# Altium schematic sheet Power.SchDoc
size A4; SheetNumber: 2; SheetTotal: 4
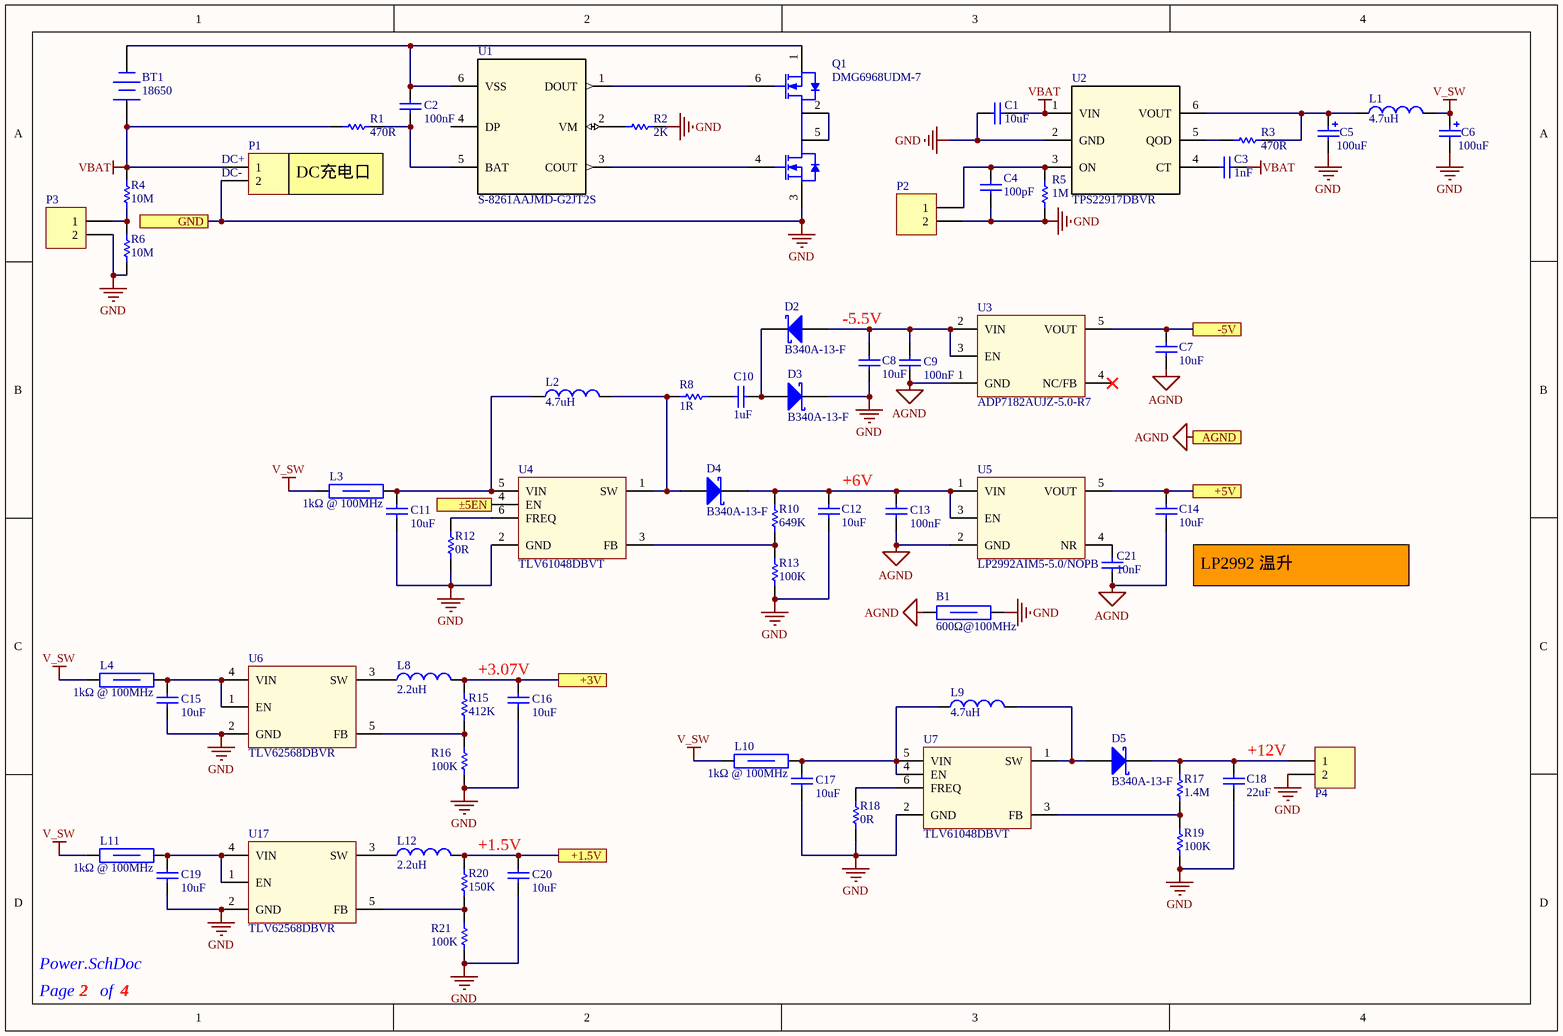
[diagram p0: Power.SchDoc]

## Parts
B1  600Ω@100MHz  [R0805_L]
BT1  18650  [CP1X2]
C1  10uF  [R0805_C]
C2  100nF  [R0603_C]
C3  1nF  [R0603_C]
C4  100pF  [R0603_C]
C5  100uF  [CASE-E_7343]
C6  100uF  [CASE-E_7343]
C7  10uF  [R0805_C]
C8  10uF  [R0805_C]
C9  100nF  [R0603_C]
C10  1uF  [R0603_C]
C11  10uF  [R0805_C]
C12  10uF  [R0805_C]
C13  100nF  [R0603_C]
C14  10uF  [R0805_C]
C15  10uF  [R0805_C]
C16  10uF  [R0805_C]
C17  10uF  [R0805_C]
C18  22uF  [R1210_C]
C19  10uF  [R0805_C]
C20  10uF  [R0805_C]
C21  10nF  [R0603_C]
D2  B340A-13-F  [SMA(DO-214AC)_S2]
D3  B340A-13-F  [SMA(DO-214AC)_S2]
D4  B340A-13-F  [SMA(DO-214AC)_S2]
D5  B340A-13-F  [SMA(DO-214AC)_S2]
L1  4.7uH  [NR2520]
L2  4.7uH  [NR2520]
L3  1kΩ @ 100MHz  [R1206_L]
L4  1kΩ @ 100MHz  [R1206_L]
L8  2.2uH  [NR2016]
L9  4.7uH  [NR2520]
L10  1kΩ @ 100MHz  [R1206_L]
L11  1kΩ @ 100MHz  [R1206_L]
L12  2.2uH  [NR2016]
P1  Header 2  [CP1X2]  (value not drawn)
P2  Header 2  [CP1X2]  (value not drawn)
P3  Header 2  [CP1X2]  (value not drawn)
P4  Header 2  [CP1X2]  (value not drawn)
Q1  DMG6968UDM-7  [DBV0006A_N]
R1  470R  [R0603_R]
R2  2K  [R0603_R]
R3  470R  [R0603_R]
R4  10M  [R0603_R]
R5  1M  [R0603_R]
R6  10M  [R0603_R]
R8  1R  [R0603_R]
R10  649K  [R0603_R]
R12  0R  [R0603_R]
R13  100K  [R0603_R]
R15  412K  [R0603_R]
R16  100K  [R0603_R]
R17  1.4M  [R0603_R]
R18  0R  [R0603_R]
R19  100K  [R0603_R]
R20  150K  [R0603_R]
R21  100K  [R0603_R]
U1  S-8261AAJMD-G2JT2S  [DBV0006A_N]
U2  TPS22917DBVR  [DBV0006A_N]
U3  ADP7182AUJZ-5.0-R7  [SOT23-5]
U4  TLV61048DBVT  [DBV0006A_N]
U5  LP2992AIM5-5.0/NOPB  [SOT23-5]
U6  TLV62568DBVR  [SOT23-5]
U7  TLV61048DBVT  [DBV0006A_N]
U17  TLV62568DBVR  [SOT23-5]

## Ports
+1.5V, +3V, +5V, -5V, AGND, GND, ±5EN

## Nets
AGND: B1.1 C7.2 C9.2 C13.2 C14.2 C21.1 U3.1(GND) U5.2(GND) ; port AGND
GND: B1.2 C1.1 C4.1 C5.2 C6.2 C8.2 C11.1 C12.1 C15.1 C16.1 C17.1 C18.1 C19.1 C20.1 D3.2(K) P1.2 P2.2 P3.2 P4.2 Q1.3(S2) R2.2 R5.1 R6.2 R12.1 R13.1 R16.1 R18.1 R19.1 R21.1 U2.2(GND) U4.2(GND) U6.2(GND) U7.2(GND) U17.2(GND) ; port GND
V_SW: C6.1 L1.2 L3.1 L4.1 L10.1 L11.1
VBAT: BT1.1(+) C1.2 C3.2 P1.1 R1.1 R4.1 U2.1(VIN)
+1.5V: C20.2 L12.2 R20.2 ; port +1.5V
+3V: C16.2 L8.2 R15.2 ; port +3V
+5V: C14.1 U5.5(VOUT) ; port +5V
-5V: C7.1 U3.5(VOUT) ; port -5V
±5EN: U4.4(EN) ; port ±5EN
NetBT1_2: BT1.2(-) C2.1 Q1.1(S1) U1.6(VSS)
NetC2_2: C2.2 R1.2 U1.5(BAT)
NetC3_1: C3.1 U2.4(CT)
NetC4_2: C4.2 P2.1 R5.2 U2.3(ON)
NetC5_1: C5.1 L1.1 R3.2 U2.6(VOUT)
NetC8_1: C8.1 C9.1 D2.1(A) U3.2(VIN) U3.3(EN)
NetC10_1: C10.1 D2.2(K) D3.1(A)
NetC10_2: C10.2 R8.2
NetC11_2: C11.2 L2.1 L3.2 U4.5(VIN)
NetC12_2: C12.2 C13.1 D4.2(K) R10.2 U5.1(VIN) U5.3(EN)
NetC15_2: C15.2 L4.2 U6.1(EN) U6.4(VIN)
NetC17_2: C17.2 L9.1 L10.2 U7.4(EN) U7.5(VIN)
NetC18_2: C18.2 D5.2(K) P4.1 R17.2
NetC19_2: C19.2 L11.2 U17.1(EN) U17.4(VIN)
NetC21_2: C21.2 U5.4(NR)
NetD4_1: D4.1(A) L2.2 R8.1 U4.1(SW)
NetD5_1: D5.1(A) L9.2 U7.1(SW)
NetL8_1: L8.1 U6.3(SW)
NetL12_1: L12.1 U17.3(SW)
NetP3_1: P3.1 R4.2 R6.1
NetQ1_2: Q1.2(D1/D2) Q1.5(D1/D2)
NetQ1_4: Q1.4(G2) U1.3(COUT)
NetQ1_6: Q1.6(G1) U1.1(DOUT)
NetR2_1: R2.1 U1.2(VM)
NetR3_1: R3.1 U2.5(QOD)
NetR10_1: R10.1 R13.2 U4.3(FB)
NetR12_2: R12.2 U4.6(FREQ)
NetR15_1: R15.1 R16.2 U6.5(FB)
NetR17_1: R17.1 R19.2 U7.3(FB)
NetR18_2: R18.2 U7.6(FREQ)
NetR20_1: R20.1 R21.2 U17.5(FB)

Not connected (* = marked no-connect by the designer): U1 4(DP); U3 4(NC/FB)*

## Notes on the sheet
- (near P1) DC+
- (near P1) DC-
- DC充电口
- -5.5V
- +6V
- (near C14) LP2992 温升17℃@100ma
- +3.07V
- (near C18) +12V
- +1.5V
- Page
- of

## Library data of the parts
B1 = 600Ω@100MHz: 600Ω @ 100MHz / 线路数 1 / 额定电流（最大） 600mA / 直流电阻（DCR）（最大） 210mΩ; 厂家: muRata(村田); 型号: BLM21AG601SN1D; 封装: 0805; 类型: Bead; 订货编码: C85837
BT1 = Battery_18650_DIP: 18650单节直插电池仓; 型号: DIP-18650; 封装: DIP; 类型: 电池盒/电池座; System: Connector; 厂家: -; 订货编码: -
C1 C7 C8 C11 C12 C14-C17 C19 C20 = 10uF/0805/16V: 精度 ±10% / 容值 10uF / 额定电压 16V / 温漂系数（介质材料) X7R; 厂家: FH(风华); 型号: 0805B106K160NT; 封装: 0805; 类型: Capacitor; 订货编码: C92341
C2 C9 C13 = 100nF/0603/50V: 精度 ±10% / 容值 100nF / 额定电压 50V / 温漂系数（介质材料) X7R; 厂家: FH(风华); 型号: 0603B104K500NT; 封装: 0603; 类型: Capacitor; 订货编码: C30926
C3 = 1nF/0603/50V: 精度 ±5% / 容值 1nF / 额定电压 50V / 温漂系数（介质材料) C0G; 厂家: FH(风华); 型号: 0603CG102J500NT; 封装: 0603; 类型: Capacitor; 订货编码: C1636
C4 = 100pF/0603/50V: 精度 ±5% / 容值 100pF / 额定电压 50V / 温漂系数（介质材料) C0G; 厂家: FH(风华); 型号: 0603CG101J500NT; 封装: 0603; 类型: Capacitor; 订货编码: C1635
C5 C6 = Cap Pol/100uF/16V: 钽电容 / 精度 ±10% / 容值 100uF / 额定电压 16V / ESR串联电阻 900 mΩ @ 100kHz / 工作温度 -55℃~125℃; 厂家: AVX; 型号: TAJE107K016RNJ; 订货编码: C106186; 封装: CASE-E_7343; 类型: 钽电容
C10 = 1uF/0603/50V: 精度 ±10% / 容值 1uF / 额定电压 50V / 温漂系数（介质材料) X7R; 厂家: FH(风华); 型号: 0603B105K500NT; 封装: 0603; 类型: Capacitor; 订货编码: C90540
C18 = 22uF/1210/25V: ±10% / 容值 22uF / 额定电压 25V / 温漂系数（介质材料) X7R; 厂家: muRata(村田); 型号: GRM32ER71E226KE15L; 封装: 1210; 类型: Capacitor; 订货编码: C21397
C21 = 10nF/0603/C0G/50V: 精度 ±5% / 容值 10nF / 额定电压 50V / 温漂系数（介质材料) C0G; 厂家: FH(风华); 型号: 0603CG103J500NT; 类型: Capacitor; 订货编码: C82282; 封装: 0603
D2-D5 = B340A-13-F: 直流反向耐压（Vr） 40V / 平均整流电流（Io） 3A / 正向压降（Vf） 550mV @ 3A; 厂家: DIODES(美台); 封装: SMA; 类型: 肖特基二极管; 订货编码: C85098; 型号: B340A-13-F
L1 L2 L9 = 4.7uH/NR2520: 精度 ±20% / 饱和电流 1.37A / 温升电流0.92A / 直流电阻（内阻） 377mΩ / 电感值 4.7uH; 厂家: TDK; 型号: VLS252012ET-4R7M; 类型: Inductor; 订货编码: C98336; 封装: NR2520
L3 L4 L10 L11 = 1kΩ@100MHz: 阻抗 @ 频率 1kΩ @ 100MHz / 线路数 1 / 额定电流（最大） 2A / 直流电阻（DCR）（最大） 120mΩ; 厂家: FH(风华); 型号: CBM321609U102T; 封装: 1206; 类型: Bead; 订货编码: C139169
L8 L12 = 2.2uH/NR2016: 精度 ±20% / 饱和电流 1.3A / 温升电流1.15A / 直流电阻（内阻） 175mΩ / 电感值 2.2uH; 厂家: Sunlord(顺络); 型号: SPH201610U2R2MT; 类型: Inductor; 订货编码: C96796; 封装: NR2016
P1-P4 = Header 2: Header, 2-Pin; 厂家: /; System: Connector; 型号: /; 封装: /; 类型: /; 订货编码: /
Q1 = DMG6968UDM-7: 漏源电压（Vdss） 20V / 连续漏极电流（Id）（25°C 时） 6.5A / 栅源极阈值电压 900mV @ 250uA / 漏源导通电阻 24mΩ @ 6.5A,4.5V / 最大功率耗散（Ta=25°C） 850mW / 类型 双N沟道(共漏); 厂家: DIODES(美台); 封装: SOT23-6; 类型: MOS(场效应管); 订货编码: C151635; 型号: DMG6968UDM-7
R1 R3 = 470R/0603: 精度 ±1% / 温度系数 ±100ppm/℃ / 功率 0.1W; 厂家: FH(风华); 型号: RS-03K4700FT; 类型: Resistor; 订货编码: C116694; 封装: 0603
R2 = 2K/0603: 精度 ±1% / 阻值 2kΩ / 温度系数 ±100ppm/℃ / 功率 0.1W; 厂家: FH(风华); 型号: RS-03K2001FT; 类型: Resistor; 订货编码: C115336; 封装: 0603
R4 R6 = 10M/0603: 温度系数 ±250ppm/℃ / 精度 ±1% / 阻值 10MΩ / 功率 0.1W; 厂家: FH(风华); 型号: RS-03L1005FT; 类型: Resistor; 订货编码: C322040; 封装: 0603
R5 = 1M/0603: 阻值 1MΩ / 精度 ±1% / 温度系数 ±100ppm/℃ / 功率 0.1W /; 厂家: FH(风华); 型号: RS-03K1004FT; 类型: Resistor; 订货编码: C136593; 封装: 0603
R8 = 1R/0603: ±250ppm/℃ / 精度 ±1% / 阻值 1Ω / 功率 0.1W; 厂家: FH(风华); 型号: RS-03L1R00FT; 类型: Resistor; 订货编码: C174300; 封装: 0603
R10 = 649K/0603: 649kΩ / 精度 ±1% / 温度系数 ±100ppm/℃ / 功率 0.1W; 厂家: FH(风华); 型号: RS-03K6493FT; 类型: Resistor; 订货编码: C321974; 封装: 0603
R12 R18 = 0R/0603: 精度 ±1% / 阻值 0Ω / 功率 0.1W; 厂家: FH(风华); 型号: RS-03000FT; 类型: Resistor; 订货编码: C136582; 封装: 0603
R13 R16 R19 R21 = 100K/0603: 精度 ±1% / 阻值 100kΩ / 温度系数 ±100ppm/℃ / 功率 0.1W; 厂家: FH(风华); 型号: RS-03K1003FT; 类型: Resistor; 订货编码: C115320; 封装: 0603
R15 = 412K/0603: 412kΩ / 精度 ±1% / 温度系数 ±100ppm/℃ / 功率 0.1W; 厂家: FH(风华); 型号: RS-03K4123FT; 类型: Resistor; 订货编码: C321899; 封装: 0603
R17 = 1.4M/0603: ±250ppm/℃ / 精度 ±1% / 阻值 1.4MΩ / 功率 0.1W; 厂家: FH(风华); 型号: RS-03L1404FT; 类型: Resistor; 订货编码: C322055; 封装: 0603
R20 = 150K/0603: 150kΩ / 精度 ±1% / 温度系数 ±100ppm/℃ / 功率 0.1W; 厂家: FH(风华); 型号: RS-03K1503FT; 类型: Resistor; 订货编码: C294649; 封装: 0603
U1 = S-8261AAJMD-G2JT2S: 单节电池保护芯片 / 过充4.325V / 过放2.5V / 过流150mV; 厂家: ABLIC(艾普凌科); 封装: SOT23-6; 类型: 电池保护芯片; 订货编码: C125801; 型号: S-8261AAJMD-G2JT2S
U2 = TPS22917DBVR: 2A负载开关; 厂家: TI(德州仪器); 封装: SOT23-6; 类型: 模拟开关; 订货编码: C2681320; 型号: TPS22917DBVR
U3 = ADP7182AUJZ-5.0-R7: –28 V、 −200 mA、低噪声线性稳压器; 厂家: ADI(亚德诺)/LINEAR; 封装: SOT-23-5; 类型: LDO; 订货编码: C514357; 型号: ADP7182AUJZ-5.0-R7
U4 U7 = TLV61048DBVT: DC-DC芯片 / 最小输入电压 2.5V / 最大输入电压 5.5V / 输出电压（最小值/固定） 0.6V / 输出电压（最大值） 5.5V / 可输出电流 1A / 开关工作频率 1.5MHz; 厂家: TI(德州仪器); 封装: SOT-23-6; 类型: DCDC; 订货编码: C2071944; 型号: TLV61048DBVT
U5 = LP2992AIM5-5.0/NOPB: 16V / 工作电源电流(Max) 4mA / 压降(max) 850mV @ 250mA / 输出电压(可调) - / 静态电流(Iq) - / 最大输出电流 250mA / 输出配置 正 / 纹波抑制(PSRR) 45dB(1kHz) / 工作温度 -40℃~125℃(Tj) / 输出电压(固定) 5V; 厂家: TI(德州仪器); 封装: SOT-23-5; 类型: LDO; 订货编码: C130001; 型号: LP2992AIM5-5.0/NOPB
U6 U17 = TLV62568DBVR: DC-DC芯片 / 最小输入电压 2.5V / 最大输入电压 5.5V / 输出电压（最小值/固定） 0.6V / 输出电压（最大值） 5.5V / 可输出电流 1A / 开关工作频率 1.5MHz; 厂家: TI(德州仪器); 封装: SOT-23-5; 类型: DCDC; 订货编码: C163219; 型号: TLV62568DBVR